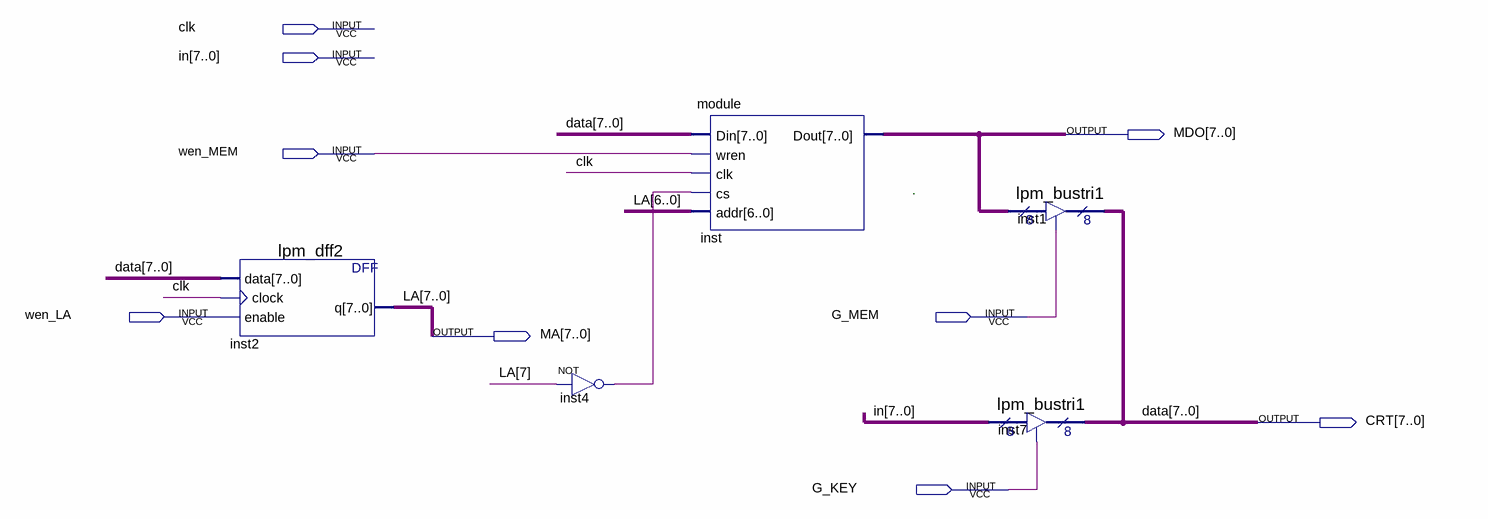
[diagram p0: schematic sheet]
// Quartus schematic bus.bdf as structural Verilog: 5 symbols, 9 pins
module bus (
  input  clk,
  input  [7:0] in,
  input  wen_MEM,
  input  wen_LA,
  input  G_MEM,
  input  G_KEY,
  output [7:0] MDO,
  output [7:0] MA,
  output [7:0] CRT
);

  wire inst4_out;

  lpm_dff2 inst2 (.data(CRT), .clock(clk), .enable(wen_LA), .q(MA));
  not inst4 (inst4_out, MA[7]);
  \module  inst (.Din(CRT), .wren(wen_MEM), .clk(clk), .cs(inst4_out), .addr(MA[6:0]), .Dout(MDO));
  lpm_bustri1 inst1 (.enabledt(G_MEM), .data(MDO), .tridata(CRT));
  lpm_bustri1 inst7 (.enabledt(G_KEY), .data(in), .tridata(CRT));

  // Other names for the same wires on the sheet: data[7:0] = CRT; LA[7:0] = MA

  // Notes on the sheet:
  //   .
endmodule
